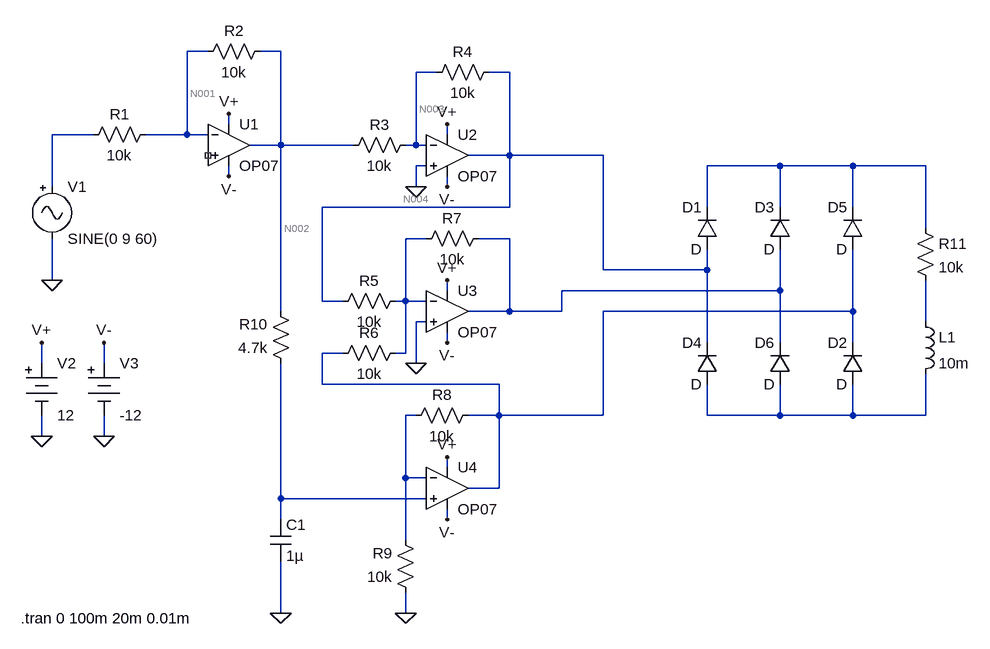
[diagram p0: schematic ThreePhaseRectifier.asc]
ThreePhaseRectifier.asc, the LTspice schematic file:
Version 4
SHEET 1 1144 840
WIRE -32 -48 -64 -48
WIRE 80 -48 48 -48
WIRE 320 -16 288 -16
WIRE 432 -16 400 -16
WIRE 0 64 0 48
WIRE -208 80 -272 80
WIRE -64 80 -64 -48
WIRE -64 80 -128 80
WIRE -32 80 -64 80
WIRE 336 80 336 64
WIRE 80 96 80 -48
WIRE 80 96 32 96
WIRE 192 96 80 96
WIRE 288 96 288 -16
WIRE 288 96 272 96
WIRE 304 96 288 96
WIRE 432 112 432 -16
WIRE 432 112 368 112
WIRE 576 112 432 112
WIRE 304 128 288 128
WIRE 848 128 736 128
WIRE 960 128 848 128
WIRE 1072 128 960 128
WIRE 0 144 0 128
WIRE -272 160 -272 80
WIRE 288 160 288 128
WIRE 336 160 336 144
WIRE 432 192 432 112
WIRE 432 192 144 192
WIRE 736 192 736 128
WIRE 848 192 848 128
WIRE 960 192 960 128
WIRE 1072 224 1072 128
WIRE 304 240 272 240
WIRE 432 240 384 240
WIRE 576 288 576 112
WIRE 736 288 736 256
WIRE 736 288 576 288
WIRE -272 304 -272 240
WIRE 336 320 336 304
WIRE 848 320 848 256
WIRE 848 320 512 320
WIRE 144 336 144 192
WIRE 176 336 144 336
WIRE 272 336 272 240
WIRE 272 336 256 336
WIRE 304 336 272 336
WIRE 80 352 80 96
WIRE 432 352 432 240
WIRE 432 352 368 352
WIRE 512 352 512 320
WIRE 512 352 432 352
WIRE 960 352 960 256
WIRE 960 352 576 352
WIRE 304 368 288 368
WIRE 1072 368 1072 304
WIRE 336 400 336 384
WIRE 736 400 736 288
WIRE 848 400 848 320
WIRE 960 400 960 352
WIRE 176 416 144 416
WIRE 272 416 272 336
WIRE 272 416 256 416
WIRE -288 432 -288 400
WIRE -192 432 -192 400
WIRE 288 432 288 368
WIRE 144 464 144 416
WIRE 416 464 144 464
WIRE 288 512 272 512
WIRE 416 512 416 464
WIRE 416 512 368 512
WIRE 576 512 576 352
WIRE 576 512 416 512
WIRE 736 512 736 464
WIRE 848 512 848 464
WIRE 848 512 736 512
WIRE 960 512 960 464
WIRE 960 512 848 512
WIRE 1072 512 1072 448
WIRE 1072 512 960 512
WIRE -288 544 -288 512
WIRE -192 544 -192 512
WIRE 336 592 336 576
WIRE 272 608 272 512
WIRE 304 608 272 608
WIRE 416 624 416 512
WIRE 416 624 368 624
WIRE 80 640 80 432
WIRE 304 640 80 640
WIRE 80 672 80 640
WIRE 336 672 336 656
WIRE 272 704 272 608
WIRE 80 816 80 736
WIRE 272 816 272 784
FLAG 288 160 0
FLAG 288 432 0
FLAG 272 816 0
FLAG 80 816 0
FLAG -272 304 0
FLAG -192 544 0
FLAG -288 544 0
FLAG -288 400 V+
FLAG -192 400 V-
FLAG 336 160 V-
FLAG 336 400 V-
FLAG 336 672 V-
FLAG 0 144 V-
FLAG 336 64 V+
FLAG 336 304 V+
FLAG 336 576 V+
FLAG 0 48 V+
SYMBOL OpAmps\\OP07 0 32 R0
SYMATTR InstName U1
SYMBOL OpAmps\\OP07 336 48 R0
SYMATTR InstName U2
SYMBOL OpAmps\\OP07 336 288 R0
SYMATTR InstName U3
SYMBOL OpAmps\\OP07 336 560 R0
SYMATTR InstName U4
SYMBOL res -112 64 R90
WINDOW 0 0 56 VBottom 2
WINDOW 3 32 56 VTop 2
SYMATTR InstName R1
SYMATTR Value 10k
SYMBOL res 64 -64 R90
WINDOW 0 0 56 VBottom 2
WINDOW 3 32 56 VTop 2
SYMATTR InstName R2
SYMATTR Value 10k
SYMBOL res 288 80 R90
WINDOW 0 0 56 VBottom 2
WINDOW 3 32 56 VTop 2
SYMATTR InstName R3
SYMATTR Value 10k
SYMBOL res 416 -32 R90
WINDOW 0 0 56 VBottom 2
WINDOW 3 32 56 VTop 2
SYMATTR InstName R4
SYMATTR Value 10k
SYMBOL res 272 320 R90
WINDOW 0 0 56 VBottom 2
WINDOW 3 32 56 VTop 2
SYMATTR InstName R5
SYMATTR Value 10k
SYMBOL res 272 400 R90
WINDOW 0 0 56 VBottom 2
WINDOW 3 32 56 VTop 2
SYMATTR InstName R6
SYMATTR Value 10k
SYMBOL res 400 224 R90
WINDOW 0 0 56 VBottom 2
WINDOW 3 32 56 VTop 2
SYMATTR InstName R7
SYMATTR Value 10k
SYMBOL res 384 496 R90
WINDOW 0 0 56 VBottom 2
WINDOW 3 32 56 VTop 2
SYMATTR InstName R8
SYMATTR Value 10k
SYMBOL res 288 800 R180
WINDOW 0 36 76 Left 2
WINDOW 3 36 40 Left 2
SYMATTR InstName R9
SYMATTR Value 10k
SYMBOL res 96 448 R180
WINDOW 0 36 76 Left 2
WINDOW 3 36 40 Left 2
SYMATTR InstName R10
SYMATTR Value 4.7k
SYMBOL cap 64 672 R0
SYMATTR InstName C1
SYMATTR Value 1µ
SYMBOL Misc\\signal -272 144 R0
WINDOW 123 0 0 Left 0
WINDOW 39 0 0 Left 0
SYMATTR InstName V1
SYMATTR Value SINE(0 9 60)
SYMBOL Misc\\battery -288 416 R0
WINDOW 123 0 0 Left 0
WINDOW 39 0 0 Left 0
SYMATTR InstName V2
SYMATTR Value 12
SYMBOL Misc\\battery -192 416 R0
WINDOW 123 0 0 Left 0
WINDOW 39 0 0 Left 0
SYMATTR InstName V3
SYMATTR Value -12
SYMBOL diode 752 256 R180
WINDOW 0 24 64 Left 2
WINDOW 3 24 0 Left 2
SYMATTR InstName D1
SYMBOL diode 976 464 R180
WINDOW 0 24 64 Left 2
WINDOW 3 24 0 Left 2
SYMATTR InstName D2
SYMBOL diode 864 256 R180
WINDOW 0 24 64 Left 2
WINDOW 3 24 0 Left 2
SYMATTR InstName D3
SYMBOL diode 752 464 R180
WINDOW 0 24 64 Left 2
WINDOW 3 24 0 Left 2
SYMATTR InstName D4
SYMBOL diode 976 256 R180
WINDOW 0 24 64 Left 2
WINDOW 3 24 0 Left 2
SYMATTR InstName D5
SYMBOL diode 864 464 R180
WINDOW 0 24 64 Left 2
WINDOW 3 24 0 Left 2
SYMATTR InstName D6
SYMBOL res 1056 208 R0
SYMATTR InstName R11
SYMATTR Value 10k
SYMBOL ind 1056 352 R0
SYMATTR InstName L1
SYMATTR Value 10m
TEXT -320 824 Left 2 !.tran 0 100m 20m 0.01m

The netlist it stands for:
* ThreePhaseRectifier.asc
XU1 NC_01 N001 V+ V- N002 LT1001  ; OP07, pins In+ In- V+ V- OUT
XU2 0 N003 V+ V- N004 LT1001  ; OP07, pins In+ In- V+ V- OUT
XU3 0 N007 V+ V- N008 LT1001  ; OP07, pins In+ In- V+ V- OUT
XU4 N013 N011 V+ V- N009 LT1001  ; OP07, pins In+ In- V+ V- OUT
R1 N001 N005 10k
R2 N002 N001 10k
R3 N003 N002 10k
R4 N004 N003 10k
R5 N007 N004 10k
R6 N007 N009 10k
R7 N008 N007 10k
R8 N009 N011 10k
R9 0 N011 10k
R10 N013 N002 4.7k
C1 N013 0 1µ
V1 N005 0 SINE(0 9 60)
V2 V+ 0 12
V3 V- 0 -12
D1 N004 N006 D
D2 N012 N009 D
D3 N008 N006 D
D4 N012 N004 D
D5 N009 N006 D
D6 N012 N008 D
R11 N006 N010 10k
L1 N010 N012 10m
.model D D
.lib standard.dio
.tran 0 100m 20m 0.01m
.lib LTC.lib
.backanno
.end

* Results of the author's LTspice run, read from the files saved beside the schematic
* Operating Point, zero values left out:
*   V(v+) = 12 V
*   V(v-) = -12 V
*   I(V3) = 9 mA
*   I(V2) = -9 mA
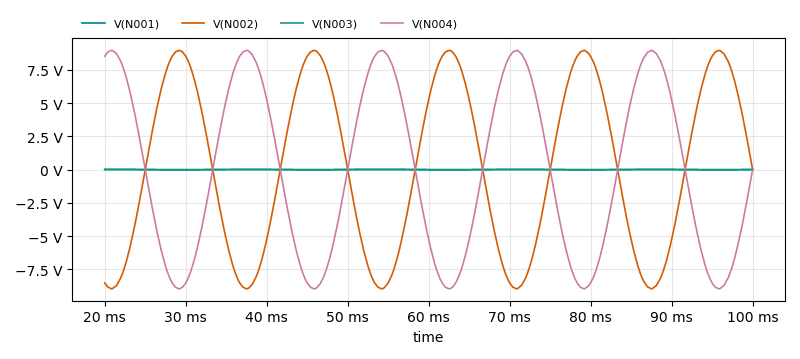
[diagram p1: Transient Analysis of ThreePhaseRectifier.asc, plotted from the saved traces]
* Transient Analysis, 1 run:
*   V(N001): min -22.59 mV, max 23.18 mV, average -265.5 µV, rms 16.22 mV, last 1.283 mV
*   V(N002): min -8.954 V, max 8.955 V, average 205.7 mV, rms 6.36 V, last 2.566 mV
*   V(N003): min -859.2 µV, max 860.1 µV, average 20.34 µV, rms 449.1 µV, last -634.3 µV
*   V(N004): min -8.955 V, max 8.954 V, average -205.7 mV, rms 6.36 V, last -3.835 mV